# EAGLE design nRF52840_qfaa_var1 (EAGLE 9.1.3)
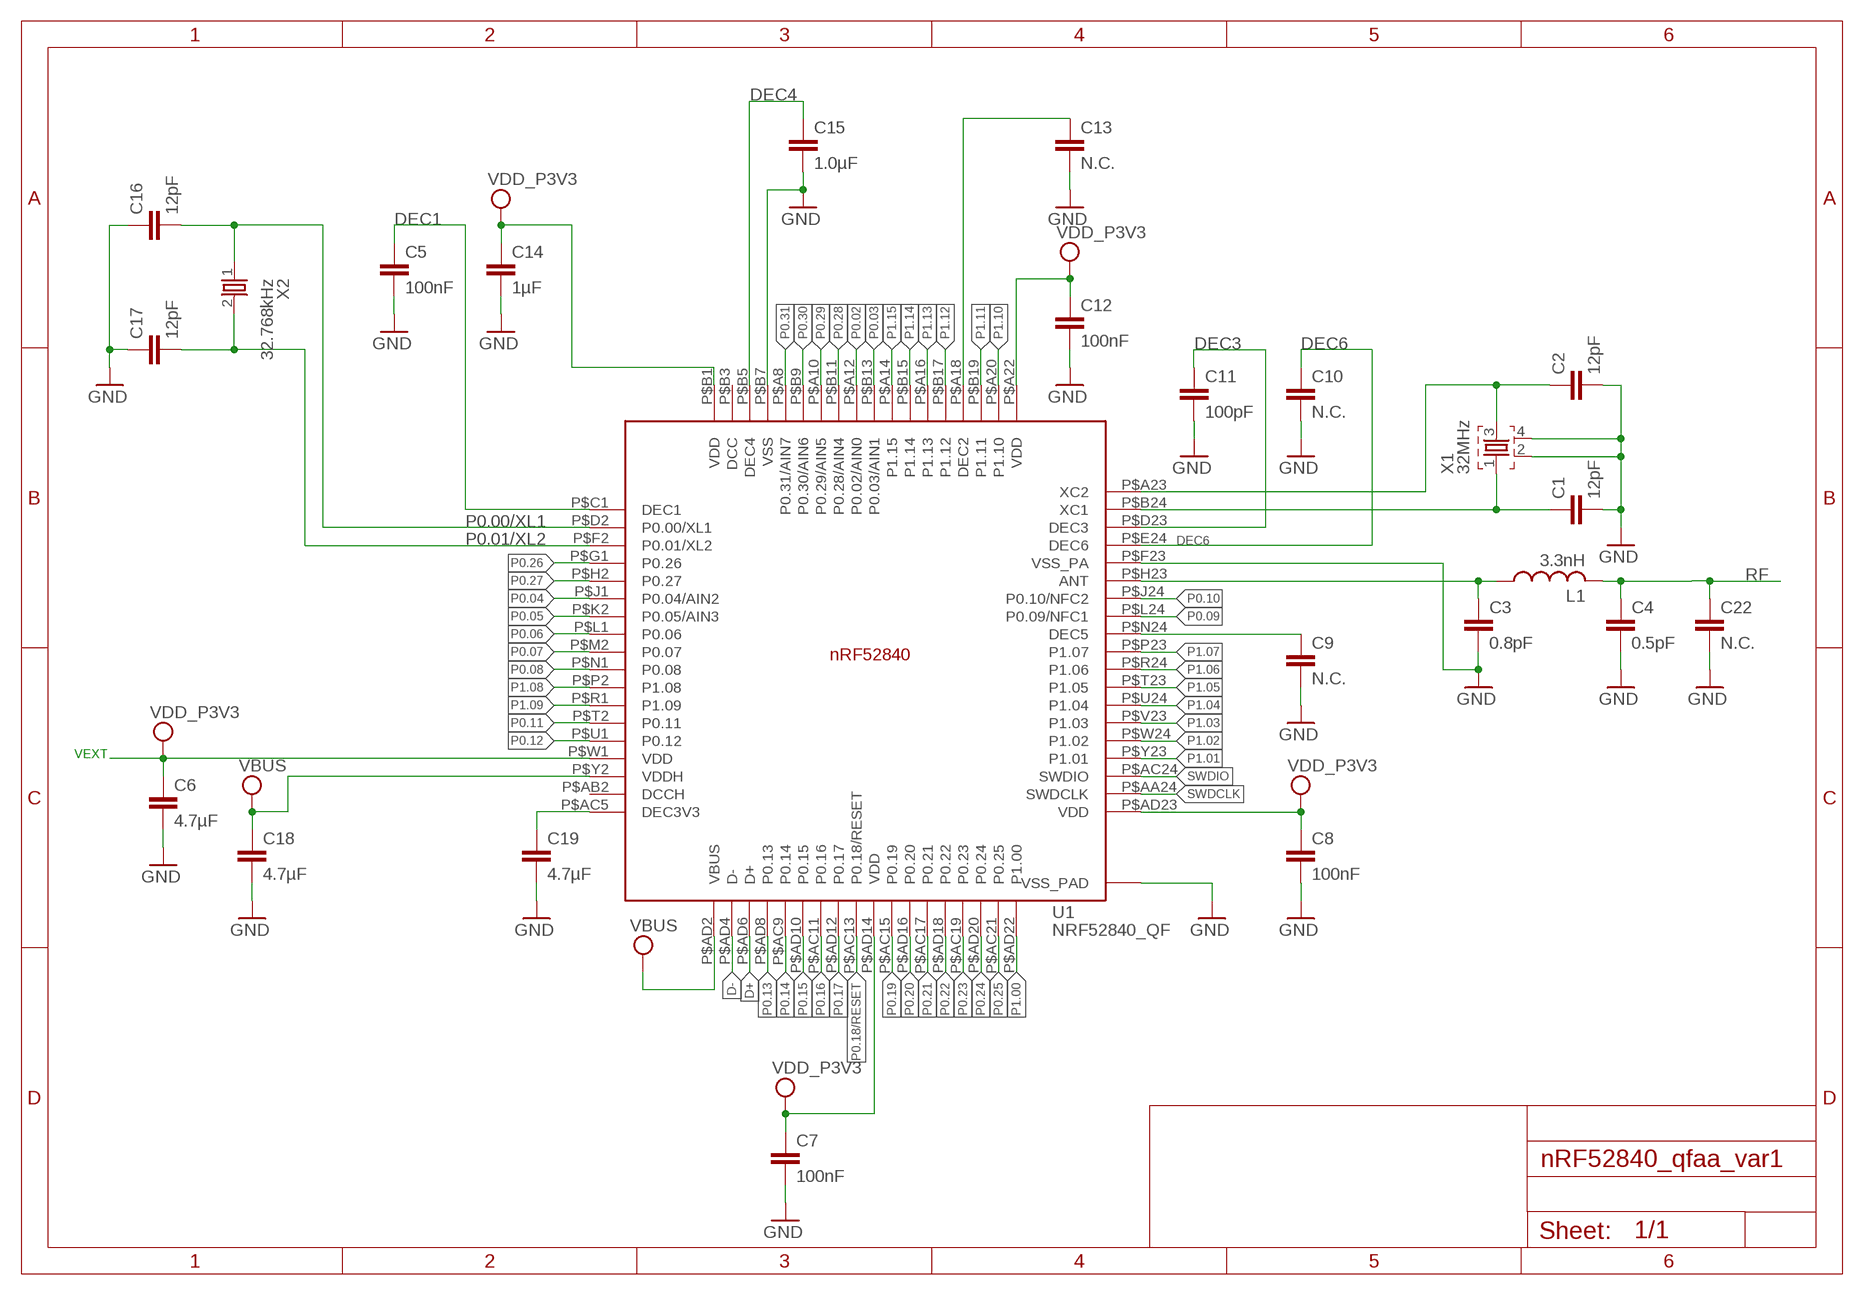
[diagram p0: schematic, sheet 1]

## Parts
C1  12pF  CAPACITOR_0402_N  [RESC0402_N]
C2  12pF  CAPACITOR_0402_N  [RESC0402_N]
C3  0.8pF  CAPACITOR_0402_N  [RESC0402_N]
C4  0.5pF  CAPACITOR_0402_N  [RESC0402_N]
C5  100nF  CAPACITOR_0402_N  [RESC0402_N]
C6  4.7µF  CAPACITOR_0603_N  [RESC0603_N]
C7  100nF  CAPACITOR_0402_N  [RESC0402_N]
C8  100nF  CAPACITOR_0402_N  [RESC0402_N]
C9  N.C.  CAPACITOR_0402_N  [RESC0402_N]
C10  N.C.  CAPACITOR_0402_N  [RESC0402_N]
C11  100pF  CAPACITOR_0402_N  [RESC0402_N]
C12  100nF  CAPACITOR_0402_N  [RESC0402_N]
C13  N.C.  CAPACITOR_0402_N  [RESC0402_N]
C14  1µF  CAPACITOR_0603_N  [RESC0603_N]
C15  1.0µF  CAPACITOR_0603_N  [RESC0603_N]
C16  12pF  CAPACITOR_0402_N  [RESC0402_N]
C17  12pF  CAPACITOR_0402_N  [RESC0402_N]
C18  4.7µF  CAPACITOR_0603_N  [RESC0603_N]
C19  4.7µF  CAPACITOR_0603_N  [RESC0603_N]
C22  N.C.  CAPACITOR_0402_N  [RESC0402_N]
L1  3.3nH  INDUCTOR_0402_N  [RESC0402_N]
U1  NRF52840_QF  [AQFN50P700X700X85_HS-74N]
X1  32MHz  XTAL_32MHZ  [BT-XTAL_2016_N]
X2  32.768kHz  XTAL_32KHZ  [XTAL_3215_N]

## Nets
ANT: C3.1 L1.1 U1.P$H23(ANT)
D+: U1.P$AD6(D+)
D-: U1.P$AD4(D-)
DEC1: C5.1 U1.P$C1(DEC1)
DEC2: C13.1 U1.P$A18(DEC2)
DEC3: C11.1 U1.P$D23(DEC3)
DEC3V3: C19.1 U1.P$AC5(DEC3V3)
DEC4: C15.1 U1.P$B5(DEC4)
DEC5: C9.1 U1.P$N24(DEC5)
DEC6: C10.1 U1.P$E24(DEC6)
GND: C1.2 C2.2 C3.2 C4.2 C5.2 C6.2 C7.2 C8.2 C9.2 C10.2 C11.2 C12.2 C13.2 C14.2 C15.2 C16.1 C17.1 C18.2 C19.2 C22.2 U1.P$74(VSS_PAD) U1.P$75(VSS_PAD) U1.P$76(VSS_PAD) U1.P$77(VSS_PAD) U1.P$78(VSS_PAD) U1.P$79(VSS_PAD) U1.P$80(VSS_PAD) U1.P$81(VSS_PAD) U1.P$82(VSS_PAD) U1.P$83(VSS_PAD) U1.P$84(VSS_PAD) U1.P$85(VSS_PAD) U1.P$86(VSS_PAD) U1.P$87(VSS_PAD) U1.P$88(VSS_PAD) U1.P$89(VSS_PAD) U1.P$90(VSS_PAD) U1.P$B7(VSS) U1.P$F23(VSS_PA) X1.2 X1.4
P0.00/XL1: C16.2 U1.P$D2(P0.00/XL1) X2.1
P0.01/XL2: C17.2 U1.P$F2(P0.01/XL2) X2.2
P0.02: U1.P$A12(P0.02/AIN0)
P0.03: U1.P$B13(P0.03/AIN1)
P0.04: U1.P$J1(P0.04/AIN2)
P0.05: U1.P$K2(P0.05/AIN3)
P0.06: U1.P$L1(P0.06)
P0.07: U1.P$M2(P0.07)
P0.08: U1.P$N1(P0.08)
P0.09: U1.P$L24(P0.09/NFC1)
P0.10: U1.P$J24(P0.10/NFC2)
P0.11: U1.P$T2(P0.11)
P0.12: U1.P$U1(P0.12)
P0.13: U1.P$AD8(P0.13)
P0.14: U1.P$AC9(P0.14)
P0.15: U1.P$AD10(P0.15)
P0.16: U1.P$AC11(P0.16)
P0.17: U1.P$AD12(P0.17)
P0.18/RESET: U1.P$AC13(P0.18/RESET)
P0.19: U1.P$AC15(P0.19)
P0.20: U1.P$AD16(P0.20)
P0.21: U1.P$AC17(P0.21)
P0.22: U1.P$AD18(P0.22)
P0.23: U1.P$AC19(P0.23)
P0.24: U1.P$AD20(P0.24)
P0.25: U1.P$AC21(P0.25)
P0.26: U1.P$G1(P0.26)
P0.27: U1.P$H2(P0.27)
P0.28: U1.P$B11(P0.28/AIN4)
P0.29: U1.P$A10(P0.29/AIN5)
P0.30: U1.P$B9(P0.30/AIN6)
P0.31: U1.P$A8(P0.31/AIN7)
P1.00: U1.P$AD22(P1.00)
P1.01: U1.P$Y23(P1.01)
P1.02: U1.P$W24(P1.02)
P1.03: U1.P$V23(P1.03)
P1.04: U1.P$U24(P1.04)
P1.05: U1.P$T23(P1.05)
P1.06: U1.P$R24(P1.06)
P1.07: U1.P$P23(P1.07)
P1.08: U1.P$P2(P1.08)
P1.09: U1.P$R1(P1.09)
P1.10: U1.P$A20(P1.10)
P1.11: U1.P$B19(P1.11)
P1.12: U1.P$B17(P1.12)
P1.13: U1.P$A16(P1.13)
P1.14: U1.P$B15(P1.14)
P1.15: U1.P$A14(P1.15)
RF: C4.1 C22.1 L1.2
SWDCLK: U1.P$AA24(SWDCLK)
SWDIO: U1.P$AC24(SWDIO)
VBUS: C18.1 U1.P$AD2(VBUS) U1.P$Y2(VDDH)
VDD_P3V3: C6.1 C7.1 C8.1 C12.1 C14.1 U1.P$A22(VDD) U1.P$AD14(VDD) U1.P$AD23(VDD) U1.P$B1(VDD) U1.P$W1(VDD)
XC1: C1.1 U1.P$B24(XC1) X1.1
XC2: C2.1 U1.P$A23(XC2) X1.3
Unconnected: U1.P$AB2(DCCH) U1.P$B3(DCC)

## Notes on the sheet
- VEXT

## Library data of the parts
C1-C19 C22 = Nordic_nRF:CAPACITOR: Generic chip capacitor
L1 = Nordic_nRF:INDUCTOR: Generic chip inductor
U1 = Nordic_nRF:NRF52840_QF: nRF52840 Features Advanced Single chip 2.4 GHz multi-protocol SoC 32-bit ARM Cortex-M4F Processor 1.7v to 5.5v operation 1MB flash + 256kB RAM Bluetooth 5 support for long range and high throughput 802.15.4 radio support On-chip NFC PPI –Programmable Peripheral Interconnect Automated power management system with automatic power management of each peripheral Configurable I/O mapping for analog and digital I/O 48 x GPIO 1 x QSPI 4 x Master/Slave SPI 2 x Two-wire interface (I²C) I²S interface 2 x UART 4 x PWM USB 2.0 controller ARM TrustZone CryptoCell-310 Cryptographic and security module AES 128-bit ECB/CCM/AAR hardware accelerator Digital microphone interface (PDM) Quadrature decoder 12-bit ADC Low power comparator On-chip 50Ω balun On-air compatible with nRF52, nRF51 and nRF24 Series Applications Advanced high performance wearables Wearables for secure payments Virtual Reality/Augmented Reality systems Smart Home sensor networks Smart city sensor networks High performance HID controllers Internet of Things (IoT) sensor networks Smart door locks Smart lighting networks Connected white goods
X1 = Nordic_nRF:XTAL_32MHZ
X2 = Nordic_nRF:XTAL_32KHZ

## Board
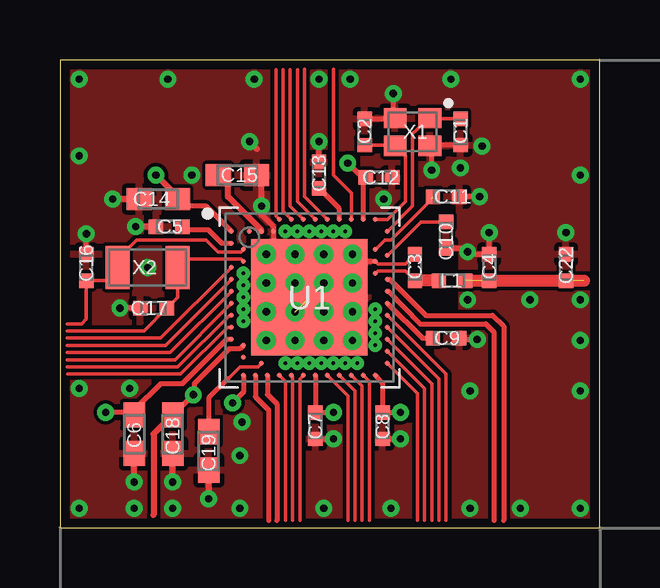
[diagram p1: board, top side]
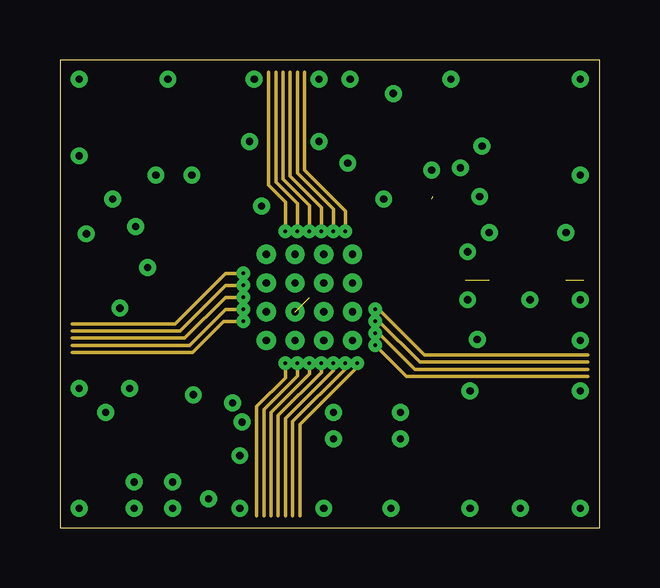
[diagram p2: board, inner layer Route2]
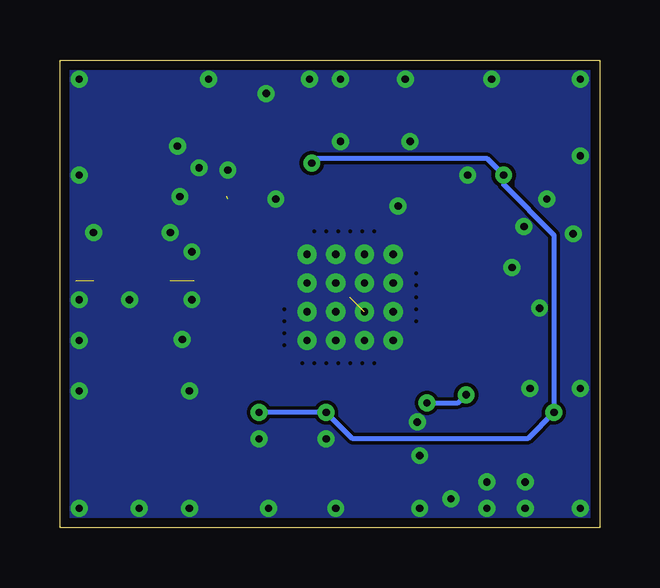
[diagram p3: board, bottom side, seen from below]

Size 22.5 x 19.5 mm. Coordinates in mm from the lower left corner, seen from the top.
Outline: 0,0 22.5,0 22.5,19.5 0,19.5 0,0
Copper layers ((1+2)*15+16): Top 0.035mm / dielectric 0.2mm / Route2 0.035mm / dielectric 1.1mm / Route15 0.035mm / dielectric 0.2mm / Bottom 0.035mm
Design rules "Nordic *": minimum track width 0.15mm, minimum drill 0.4mm, track to track 0.15mm, track to pad 0.15mm, pad to pad 0.15mm, via to via 0.15mm, smd to smd 0.15mm, copper to edge 0.4mm, drill to drill 0.4mm, minimum pad ring 10mil, minimum via ring 8mil, stop-mask expansion 4mil, vias tented up to drill 0mil, thermal gap 0.2mm
tRestrict: area 13,8.8 to 16.6,11.4; area 13.8,10.8 to 15.8,12.8

### Footprints (pad centres in the part's own frame; a part is rotated, then mirrored left to right if it is on the bottom)
RESC0402_N = smd 0.6 x 0.6: 1 -0.55,0; 2 0.55,0
RESC0603_N = smd 1.05 x 0.9: 1 -0.8,0; 2 0.8,0
AQFN50P700X700X85_HS-74N = smd 4.85 x 4.85: P$74 0,0 | drill 0.3 pad 0.6: P$75 -1.8,1.8; P$76 -0.6,1.8; P$77 0.6,1.8; P$78 1.8,1.8; P$79 -1.8,0.6; P$80 -0.6,0.6; P$81 0.6,0.6; P$82 1.8,0.6; P$83 -1.8,-0.6; P$84 -0.6,-0.6; P$85 0.6,-0.6; P$86 1.8,-0.6; P$87 -1.8,-1.8; P$88 -0.6,-1.8; P$89 0.6,-1.8; P$90 1.8,-1.8 | smd 0.2 x 0.2: P$A8 -1.25,3.25; P$A10 -0.75,3.25; P$A12 -0.25,3.25; P$A14 0.25,3.25; P$A16 0.75,3.25; P$A18 1.25,3.25; P$A20 1.75,3.25; P$A22 2.25,3.25; P$A23 2.75,3.25; P$AA24 3.25,-2.25; P$AB2 -2.75,-2.5; P$AC5 -2,-2.75; P$AC9 -1,-2.75; P$AC11 -0.5,-2.75; P$AC13 0,-2.75; P$AC15 0.5,-2.75; P$AC17 1,-2.75; P$AC19 1.5,-2.75; P$AC21 2,-2.75; P$AC24 3.25,-2.75; P$AD2 -2.75,-3.25; P$AD4 -2.25,-3.25; P$AD6 -1.75,-3.25; P$AD8 -1.25,-3.25; P$AD10 -0.75,-3.25; P$AD12 -0.25,-3.25; P$AD14 0.25,-3.25; P$AD16 0.75,-3.25; P$AD18 1.25,-3.25; P$AD20 1.75,-3.25; P$AD22 2.25,-3.25; P$AD23 2.75,-3.25; P$B1 -3.25,2.75; P$B3 -2.5,2.75; P$B5 -2,2.75; P$B7 -1.5,2.75; P$B9 -1,2.75; P$B11 -0.5,2.75; P$B13 0,2.75; P$B15 0.5,2.75; P$B17 1,2.75; P$B19 1.5,2.75; P$B24 3.25,2.75; P$C1 -3.25,2.25; P$D2 -2.75,2; P$D23 2.75,2; P$E24 3.25,1.75; P$F2 -2.75,1.5; P$F23 2.75,1.5; P$G1 -3.25,1.25; P$H2 -2.75,1; P$H23 2.75,1; P$J1 -3.25,0.75; P$J24 3.25,0.75; P$K2 -2.75,0.5; P$L1 -3.25,0.25; P$L24 3.25,0.25; P$M2 -2.75,0; P$N1 -3.25,-0.25; P$N24 3.25,-0.25; P$P2 -2.75,-0.5; P$P23 2.75,-0.5; P$R1 -3.25,-0.75; P$R24 3.25,-0.75; P$T2 -2.75,-1; P$T23 2.75,-1; P$U1 -3.25,-1.25; P$U24 3.25,-1.25; P$V23 2.75,-1.5; P$W1 -3.25,-1.75; P$W24 3.25,-1.75; P$Y2 -2.75,-2; P$Y23 2.75,-2
BT-XTAL_2016_N = smd 0.95 x 0.85: 1 -0.725,-0.575; 2 0.725,-0.575; 3 0.725,0.575; 4 -0.725,0.575
XTAL_3215_N = smd 1 x 1.8: 1 -1.25,0; 2 1.25,0

### Placement (x,y rotation side)
C1  16.7,16.5 270 top
C2  12.7,16.5 90 top
C3  14.8,10.85 90 top
C4  17.9,10.85 90 top
C5  4.55,12.55 180 top
C6  3.1,3.9 270 top
C7  10.65,4.25 270 top
C8  13.45,4.25 270 top
C9  16.1,7.9 0 top
C10  16.1,12.2 270 top
C11  16.1,13.8 0 top
C12  13.3,14.6 0 top
C13  10.8,14.7 90 top
C14  4.1,13.7 180 top
C15  7.4,14.7 0 top
C16  1.1,10.85 270 top
C17  3.9,9.15 0 top
C18  4.7,3.9 270 top
C19  6.2,3.2 270 top
C22  21.1,10.85 90 top
L1  16.35,10.3 0 top
U1  10.4,9.6 0 top
X1  14.7,16.5 180 top
X2  3.65,10.85 0 top

### Tracks (layer width: path | path; a pad name or v marks a point on that pad's centre or on a via)
ANT
  Top 0.15: C3.1 14.4,10.7 13.25,10.7 U1.P$H23
  Top 0.5: L1.1 C3.1
D+
  Top 0.2: U1.P$AD6 8.65,5.55 9.05,5.15 9.05,0.3
D-
  Top 0.2: U1.P$AD4 8.15,5.45 8.7,4.9 8.7,0.3
DEC1
  Top 0.2: U1.P$C1 6.75,11.85 6.2,12.4 5.15,12.4 C5.1
DEC2
  Top 0.2: U1.P$A18 11.65,13.3 C13.1
DEC3  (1 unrouted)
  Top 0.15: U1.P$D23 13.55,12 13.8,12 15.5,13.7
DEC3V3
  Top 0.15: U1.P$AC5 8.25,6.7 7.5,6.7 7,6.2
  Top 0.2: 7,6.2 6.2,5.4 C19.1
DEC4
  Top 0.2: 6.6,14.64 C15.1
  Top 0.25: U1.P$B5 8.4,12.4 7,13.8 7,14.24 6.6,14.64
DEC5
  Top 0.2: U1.P$N24 15.11,7.9 C9.1
DEC6
  Top 0.15: C10.1 15.05,12.75 U1.P$E24
  Top 0.2: 16.15,12.8 C10.1
GND  (via drill 0.3 pad 0.6)  (1 unrouted)
  Top 0.15: C3.2 14.4,11 13.25,11 U1.P$F23
  Top 0.2: 8.4,13.05 8.9,12.55 U1.P$B7 8.9,11.7 U1.P$75 | 8.4,14.6 8.35,14.65 | U1.P$F23 12.5,11.1 U1.P$78 | C7.2 v11.4,3.7 | C8.2 v14.2,3.7 | v17.4,7.85 16.7,7.85 C9.2 | C10.2 16.85,11.65 v17,11.5 17.1,11.4 C4.2 v17.9,12.3 | v17.5,13.8 C11.2 | v15.5,14.9 15.5,15.85 15.48,15.87 | 15.48,15.87 X1.4 | C1.2 15.57,15.95 15.48,15.87 | 13.9,17.15 v13.9,18.1 | 13.9,17.15 X1.2 | C2.2 13.8,17.05 13.9,17.15 | C13.2 v10.8,16.1 | C16.1 v1.1,12.25 | C17.1 v2.5,9.15
  Top 0.25: 8.4,13.05 8.4,14.6 | C14.2 v2.2,13.7 | C5.2 v3.15,12.55 | v3.1,1.9 C6.2 | v4.7,1.9 C18.2 | C19.2 v6.2,1.2 | 8.2,15.8 v7.9,16.1
  other vias: 19.6,9.5 17,9.5 3.65,10.85 8.4,13.4 13.5,13.7 2.9,5.8 5.5,14.7 0.8,18.7 4.5,18.7 8.1,18.7 10.8,18.7 12.1,18.7 0.8,15.5 16.3,18.7 17.6,15.9 16.7,15 21.7,18.7 21.7,14.7 21.1,12.3 21.7,9.5 21.7,7.8 21.7,5.7 21.7,0.8 19.2,0.8 17.1,0.8 17.1,5.7 13.8,0.8 11,0.8 7.5,0.8 4.7,0.8 3.1,0.8 0.8,0.8 0.8,5.8 7.6,4.4 7.5,3
  pour Top: 0,0 0,19.5 22.5,19.5 22.5,0
  pour Bottom: 0,0 0,19.5 22.5,19.5 22.5,0
P0.00/XL1
  Top 0.15: U1.P$D2 7.55,11.5 6.6,11.5 6.1,12 3.2,12 2.4,11.2 X2.1 2.4,10.3 C16.2 1.1,8.7 0.9,8.5 0.47,8.5 0.3,8.5
P0.01/XL2
  Top 0.15: U1.P$F2 7.55,11.2 4.9,11.2 X2.2 4.9,9.6 C17.2 3.5,8.2 0.3,8.2
P0.02
  Top 0.15: U1.P$A12 9.6,13.4 9.6,19.1
P0.03  (via drill 0.15 pad 0.35 layers 1-2)
  Route2 0.15: U1.P$B13 10.4,13.43 9.3,14.53 9.3,19
  other vias: 10.4,12.35
P0.04
  Top 0.15: U1.P$J1 4.4,7.6 0.3,7.6
P0.05  (via drill 0.15 pad 0.35 layers 1-2)
  Route2 0.15: U1.P$K2 6.9,10.1 5,8.2 0.5,8.2
  other vias: 7.65,10.1
P0.06
  Top 0.15: 0.3,7.3 4.15,7.3 4.6,7.3 U1.P$L1
P0.07  (via drill 0.15 pad 0.35 layers 1-2)
  Route2 0.15: U1.P$M2 6.9,9.6 5.2,7.9 0.5,7.9
  other vias: 7.65,9.6
P0.08
  Top 0.15: U1.P$N1 6.95,9.15 6.94,9.15 4.79,7 0.3,7
P0.09
  Top 0.2: 18.1,0.3 18.1,8.15 17.75,8.5 15,8.5 13.7,9.85 U1.P$L24
P0.10
  Top 0.2: U1.P$J24 13.75,10.35 15.25,8.85 18.05,8.85 18.5,8.4 18.5,0.3
P0.11  (via drill 0.15 pad 0.35 layers 1-2)
  Route2 0.15: U1.P$T2 6.82,8.6 5.52,7.3 0.5,7.3
  other vias: 7.65,8.6
P0.12
  Top 0.15: U1.P$U1 6.99,8.35 5.04,6.4 0.9,6.4 | 0.9,6.4 0.33,6.4 0.9,6.4
P0.13
  Top 0.15: U1.P$AD8 9.4,6.1 9.4,0.3
P0.14  (via drill 0.15 pad 0.35 layers 1-2)
  Route2 0.15: U1.P$AC9 9.4,6.25 8.2,5.05 8.2,0.5
  other vias: 9.4,6.85
P0.15
  Top 0.15: U1.P$AD10 9.65,6.32 9.7,6.27 9.7,0.3
P0.16  (via drill 0.15 pad 0.35 layers 1-2)
  Route2 0.15: U1.P$AC11 9.9,6.32 8.5,4.92 8.5,0.5
  other vias: 9.9,6.85
P0.17
  Top 0.15: U1.P$AD12 10,6.2 10,0.3
P0.18/RESET  (via drill 0.15 pad 0.35 layers 1-2)
  Route2 0.15: U1.P$AC13 10.4,6.4 8.8,4.8 8.8,0.5
  other vias: 10.4,6.85
P0.19  (via drill 0.15 pad 0.35 layers 1-2)
  Route2 0.15: U1.P$AC15 10.9,6.47 9.1,4.67 9.1,0.5
  other vias: 10.9,6.85
P0.20
  Top 0.15: U1.P$AD16 12,5.5 12,0.3
P0.21  (via drill 0.15 pad 0.35 layers 1-2)
  Route2 0.15: U1.P$AC17 11.4,6.55 9.4,4.55 9.4,0.5
  other vias: 11.4,6.85
P0.22
  Top 0.15: 12.3,0.3 12.3,5.7 U1.P$AD18
P0.23  (via drill 0.15 pad 0.35 layers 1-2)
  Route2 0.15: U1.P$AC19 11.9,6.62 9.7,4.42 9.7,0.5
  other vias: 11.9,6.85
P0.24
  Top 0.15: 12.6,0.3 12.6,5.9 U1.P$AD20
P0.25  (via drill 0.15 pad 0.35 layers 1-2)
  Route2 0.15: U1.P$AC21 12.4,6.7 10,4.3 10,0.5
  other vias: 12.4,6.85
P0.26
  Top 0.15: U1.P$G1 4.2,7.9 0.3,7.9
P0.27  (via drill 0.15 pad 0.35 layers 1-2)
  Route2 0.15: U1.P$H2 6.9,10.6 4.8,8.5 0.5,8.5
  other vias: 7.65,10.6
P0.28  (via drill 0.15 pad 0.35 layers 1-2)
  Route2 0.15: U1.P$B11 9.9,13.5 9,14.4 9,19
  other vias: 9.9,12.35
P0.29
  Top 0.15: U1.P$A10 9.3,13.2 9.3,19.1
P0.30  (via drill 0.15 pad 0.35 layers 1-2)
  Route2 0.15: U1.P$B9 9.4,13.58 8.7,14.28 8.7,19
  other vias: 9.4,12.35
P0.31
  Top 0.15: U1.P$A8 9,13 9,19.1
P1.00
  Top 0.15: 12.9,0.3 12.9,6.1 U1.P$AD22
P1.01  (via drill 0.15 pad 0.35 layers 1-2)
  Route2 0.15: U1.P$Y23 14.45,6.3 22,6.3
  other vias: 13.15,7.6
P1.02
  Top 0.15: U1.P$W24 15.5,6 15.5,0.3
P1.03  (via drill 0.15 pad 0.35 layers 1-2)
  Route2 0.15: U1.P$V23 13.3,8.1 14.8,6.6 22,6.6
  other vias: 13.15,8.1
P1.04
  Top 0.15: U1.P$U24 15.8,6.2 15.8,0.3
P1.05  (via drill 0.15 pad 0.35 layers 1-2)
  Route2 0.15: 13.3,8.6 U1.P$T23 13.3,8.6 | 13.3,8.6 15,6.9 22,6.9
  other vias: 13.15,8.6
P1.06
  Top 0.15: U1.P$R24 16.1,6.4 16.1,0.3
P1.07  (via drill 0.15 pad 0.35 layers 1-2)
  Route2 0.15: U1.P$P23 13.3,9.1 15.2,7.2 22,7.2
  other vias: 13.15,9.1
P1.08  (via drill 0.15 pad 0.35 layers 1-2)
  Route2 0.15: U1.P$P2 6.9,9.1 5.4,7.6 0.5,7.6
  other vias: 7.65,9.1
P1.09
  Top 0.15: 0.3,6.7 4.92,6.7 7.07,8.85 U1.P$R1
P1.10
  Top 0.15: U1.P$A20 12.15,13.95 11.4,14.7 11.4,19.12
P1.11  (via drill 0.15 pad 0.35 layers 1-2)
  Route2 0.15: U1.P$B19 11.9,13.2 10.2,14.9 10.2,19
  other vias: 11.9,12.35
P1.12  (via drill 0.15 pad 0.35 layers 1-2)
  Route2 0.15: U1.P$B17 11.4,13.28 9.9,14.78 9.9,19
  other vias: 11.4,12.35
P1.13
  Top 0.15: U1.P$A16 10.2,13.8 10.2,19.12
P1.14  (via drill 0.15 pad 0.35 layers 1-2)
  Route2 0.15: U1.P$B15 10.9,13.35 9.6,14.65 9.6,19
  other vias: 10.9,12.35
P1.15
  Top 0.15: U1.P$A14 9.9,13.6 9.9,19.1
RF  (2 unrouted)
  Top 0.5: L1.2 21.85,10.3
SWDCLK
  Top 0.15: U1.P$AA24 15.2,5.8 15.2,0.3
SWDIO
  Top 0.15: U1.P$AC24 14.9,5.6 14.9,0.3
VBUS  (via drill 0.3 pad 0.6)
  Top 0.2: U1.P$Y2 7.5,7.45 7.05,7.45 5.6,6 5.6,5.58 v5.56,5.54 4.72,4.7 C18.1 4.9,4.9 | U1.P$AD2 7.65,5.65 v7.2,5.2
  Top 0.25: C18.1 3.9,3.9 3.9,0.53
  Bottom 0.2: v7.2,5.2 5.9,5.2 v5.56,5.54
VDD_P3V3  (via drill 0.3 pad 0.6)
  Top 0.2: U1.P$A22 12.65,14.5 | 12.65,14.5 C12.1 | 12.65,14.5 12.65,14.55 v12,15.2 | U1.P$AD14 C7.1 v11.4,4.8 | U1.P$AD23 13.45,6 C8.1 v14.2,4.8 | U1.P$W1 6.95,7.85 5.1,6 4.2,6 3.1,4.9 C6.1 3,4.8 v1.9,4.8 | U1.P$B1 6.1,13.4 5.2,13.4 C14.1
  Top 0.25: C14.1 4.9,13.8 v4,14.7
  Bottom 0.2: v14.2,4.8 v11.4,4.8 10.3,3.7 3,3.7 v1.9,4.8 1.9,12.2 4,14.3 v4,14.7 4.7,15.4 11.8,15.4 v12,15.2
XC1
  Top 0.15: C1.1 15.45,17.05 X1.1 15.38,17.07 14.86,16.57 14.7,16.42 14.7,13.4 U1.P$B24
XC2
  Top 0.15: C2.1 13.95,15.95 X1.3 14.4,15.5 14.4,13.6 13.65,12.85 U1.P$A23